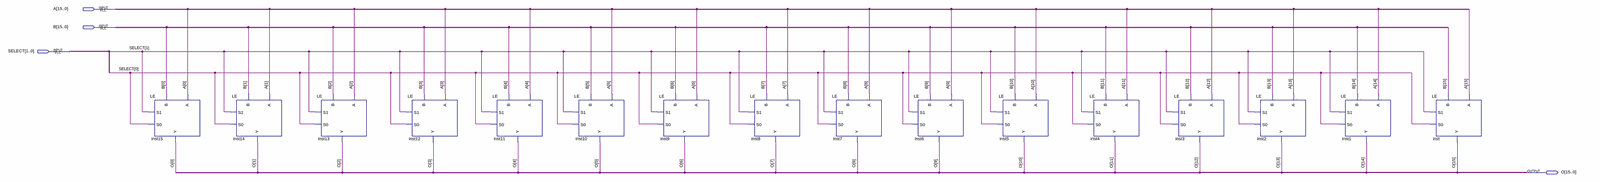
[diagram p0: schematic sheet, whole]
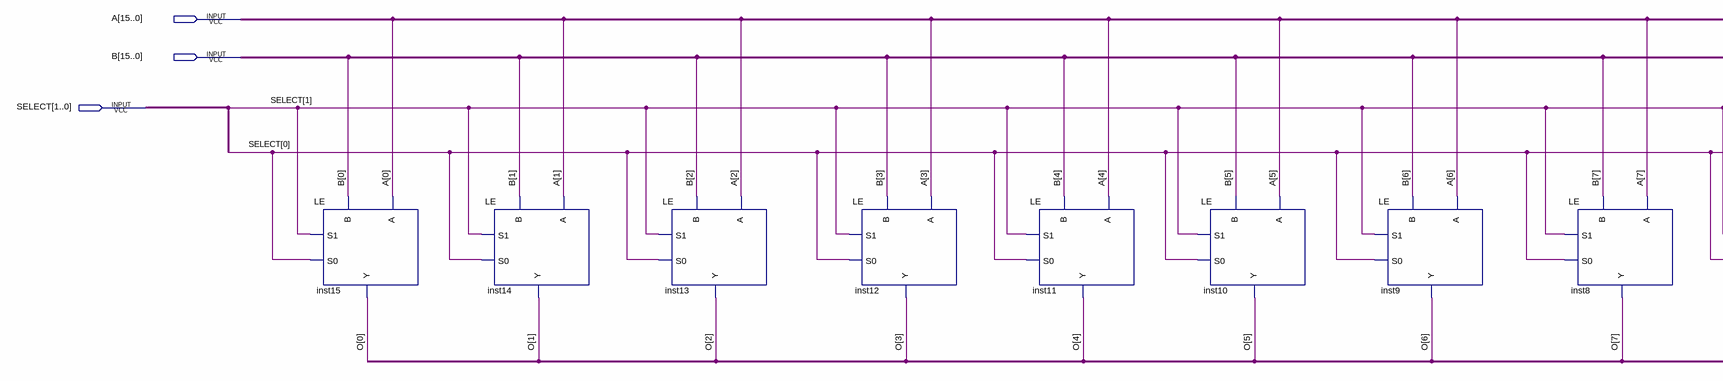
[diagram p1: schematic sheet, left part]
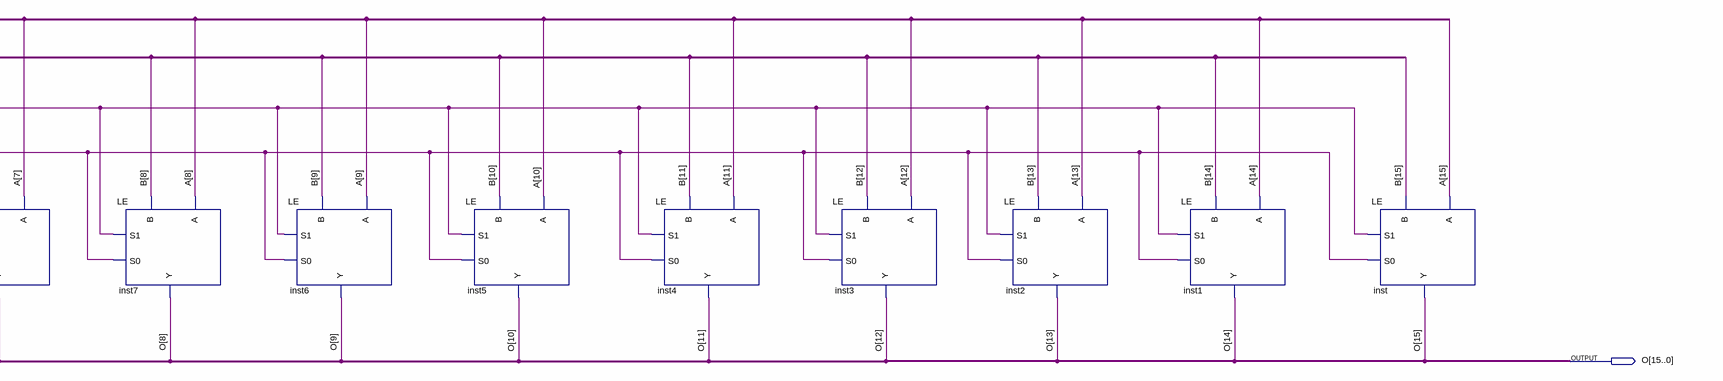
[diagram p2: schematic sheet, right part]
// Quartus schematic LU.bdf as structural Verilog: 16 symbols, 4 pins
module LU (
  input  [15:0] A,
  input  [15:0] B,
  input  [1:0] SELECT,
  output [15:0] O
);

  LE inst15 (.A(A[0]), .B(B[0]), .S1(SELECT[1]), .S0(SELECT[0]), .Y(O[0]));
  LE inst14 (.A(A[1]), .B(B[1]), .S1(SELECT[1]), .S0(SELECT[0]), .Y(O[1]));
  LE inst13 (.A(A[2]), .B(B[2]), .S1(SELECT[1]), .S0(SELECT[0]), .Y(O[2]));
  LE inst12 (.A(A[3]), .B(B[3]), .S1(SELECT[1]), .S0(SELECT[0]), .Y(O[3]));
  LE inst11 (.A(A[4]), .B(B[4]), .S1(SELECT[1]), .S0(SELECT[0]), .Y(O[4]));
  LE inst10 (.A(A[5]), .B(B[5]), .S1(SELECT[1]), .S0(SELECT[0]), .Y(O[5]));
  LE inst9 (.A(A[6]), .B(B[6]), .S1(SELECT[1]), .S0(SELECT[0]), .Y(O[6]));
  LE inst8 (.A(A[7]), .B(B[7]), .S1(SELECT[1]), .S0(SELECT[0]), .Y(O[7]));
  LE inst7 (.A(A[8]), .B(B[8]), .S1(SELECT[1]), .S0(SELECT[0]), .Y(O[8]));
  LE inst6 (.A(A[9]), .B(B[9]), .S1(SELECT[1]), .S0(SELECT[0]), .Y(O[9]));
  LE inst5 (.A(A[10]), .B(B[10]), .S1(SELECT[1]), .S0(SELECT[0]), .Y(O[10]));
  LE inst4 (.A(A[11]), .B(B[11]), .S1(SELECT[1]), .S0(SELECT[0]), .Y(O[11]));
  LE inst3 (.A(A[12]), .B(B[12]), .S1(SELECT[1]), .S0(SELECT[0]), .Y(O[12]));
  LE inst2 (.A(A[13]), .B(B[13]), .S1(SELECT[1]), .S0(SELECT[0]), .Y(O[13]));
  LE inst1 (.A(A[14]), .B(B[14]), .S1(SELECT[1]), .S0(SELECT[0]), .Y(O[14]));
  LE inst (.A(A[15]), .B(B[15]), .S1(SELECT[1]), .S0(SELECT[0]), .Y(O[15]));
endmodule
